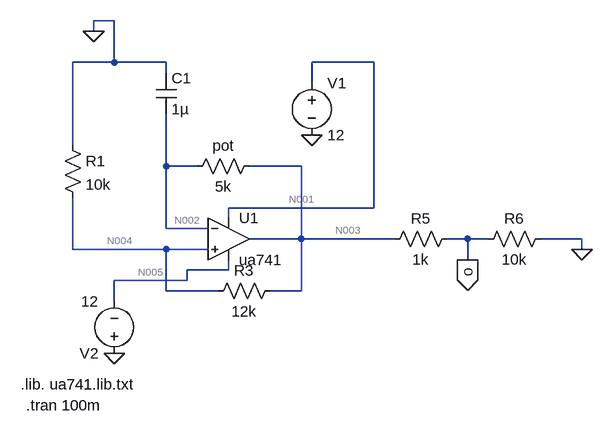
[diagram p0: schematic Square wave without pot.asc]
Square wave without pot.asc, the LTspice schematic file:
Version 4
SHEET 1 880 680
WIRE 48 -176 16 -176
WIRE 16 -160 16 -176
WIRE 48 -112 48 -176
WIRE 48 -112 -16 -112
WIRE 128 -112 48 -112
WIRE 448 -112 352 -112
WIRE 128 -96 128 -112
WIRE 352 -80 352 -112
WIRE -16 16 -16 -112
WIRE 128 48 128 -32
WIRE 176 48 128 48
WIRE 336 48 256 48
WIRE 448 112 448 -112
WIRE 448 112 224 112
WIRE 224 128 224 112
WIRE 128 144 128 48
WIRE 192 144 128 144
WIRE 336 160 336 48
WIRE 336 160 256 160
WIRE 480 160 336 160
WIRE 592 160 560 160
WIRE 624 160 592 160
WIRE 768 160 704 160
WIRE -16 176 -16 96
WIRE 128 176 -16 176
WIRE 192 176 128 176
WIRE 768 176 768 160
WIRE 592 192 592 160
WIRE 224 208 224 192
WIRE 224 208 160 208
WIRE 160 224 160 208
WIRE 160 224 48 224
WIRE 128 240 128 176
WIRE 208 240 128 240
WIRE 336 240 336 160
WIRE 336 240 288 240
WIRE 48 256 48 224
FLAG 16 -160 0
FLAG 48 336 0
FLAG 352 0 0
FLAG 768 176 0
FLAG 592 192 o
IOPIN 592 192 Out
SYMBOL res -32 0 R0
SYMATTR InstName R1
SYMATTR Value 10k
SYMBOL res 272 32 R90
WINDOW 0 0 56 VBottom 2
WINDOW 3 32 56 VTop 2
SYMATTR InstName pot
SYMATTR Value 5k
SYMBOL cap 112 -96 R0
SYMATTR InstName C1
SYMATTR Value 1µ
SYMBOL res 304 224 R90
WINDOW 0 0 56 VBottom 2
WINDOW 3 32 56 VTop 2
SYMATTR InstName R3
SYMATTR Value 12k
SYMBOL voltage 352 -96 R0
WINDOW 123 0 0 Left 0
WINDOW 39 0 0 Left 0
SYMATTR InstName V1
SYMATTR Value 12
SYMBOL voltage 48 352 R180
WINDOW 123 0 0 Left 0
WINDOW 39 0 0 Left 0
SYMATTR InstName V2
SYMATTR Value 12
SYMBOL OpAmps\\ua741 224 96 R0
SYMATTR InstName U1
SYMBOL res 720 144 R90
WINDOW 0 0 56 VBottom 2
WINDOW 3 32 56 VTop 2
SYMATTR InstName R6
SYMATTR Value 10k
SYMBOL res 464 176 R270
WINDOW 0 32 56 VTop 2
WINDOW 3 0 56 VBottom 2
SYMATTR InstName R5
SYMATTR Value 1k
TEXT -88 416 Left 2 !.tran 100m
TEXT -96 384 Left 2 !.lib. ua741.lib.txt

The netlist it stands for:
* Square wave without pot.asc
R1 0 N004 10k
R§pot N003 N002 5k
C1 0 N002 1µ
R3 N003 N004 12k
V1 N001 0 12
V2 0 N005 12
XU1 N004 N002 N001 N005 N003 ua741  ; pins In+ In- V+ V- OUT
R6 0 o 10k
R5 N003 o 1k
.tran 100m
.lib. ua741.lib.txt
.backanno
.end

* Results of the author's LTspice run, read from the files saved beside the schematic
* Operating Point, zero values left out:
*   V(n004) = -448.9 µV
*   V(n003) = -30.76 µV
*   V(n002) = -429.6 µV
*   V(n001) = 12 V
*   V(n005) = -12 V
*   V(o) = -27.97 µV
*   I(R5) = -2.797 nA
*   I(R6) = 2.797 nA
*   I(R3) = 34.84 nA
*   I(Pot) = 79.76 nA
*   I(R1) = 44.89 nA
*   I(V2) = -1.337 mA
*   I(V1) = -1.337 mA
*   Ix(u1:1) = 79.73 nA
*   Ix(u1:2) = 79.76 nA
*   Ix(u1:3) = 1.337 mA
*   Ix(u1:4) = -1.337 mA
*   Ix(u1:5) = -111.8 nA
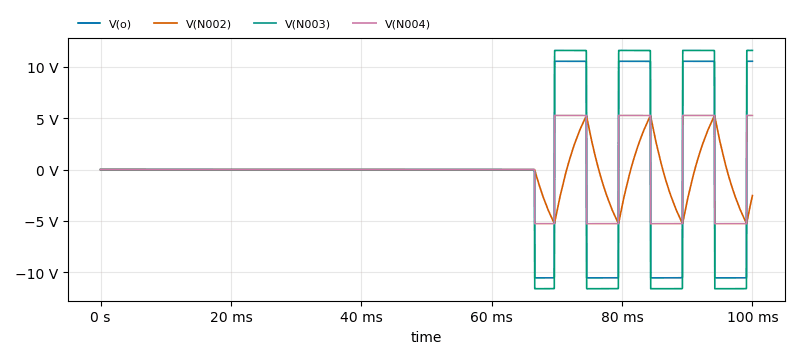
[diagram p1: Transient Analysis of Square wave without pot.asc, plotted from the saved traces]
* Transient Analysis, 1 run:
*   V(o): min -10.56 V, max 10.56 V, average -227.1 mV, rms 6.082 V, last 10.56 V
*   V(N002): min -5.265 V, max 5.264 V, average -123.7 mV, rms 1.865 V, last -2.533 V
*   V(N003): min -11.62 V, max 11.62 V, average -249.8 mV, rms 6.691 V, last 11.61 V
*   V(N004): min -5.282 V, max 5.281 V, average -114 mV, rms 3.041 V, last 5.278 V